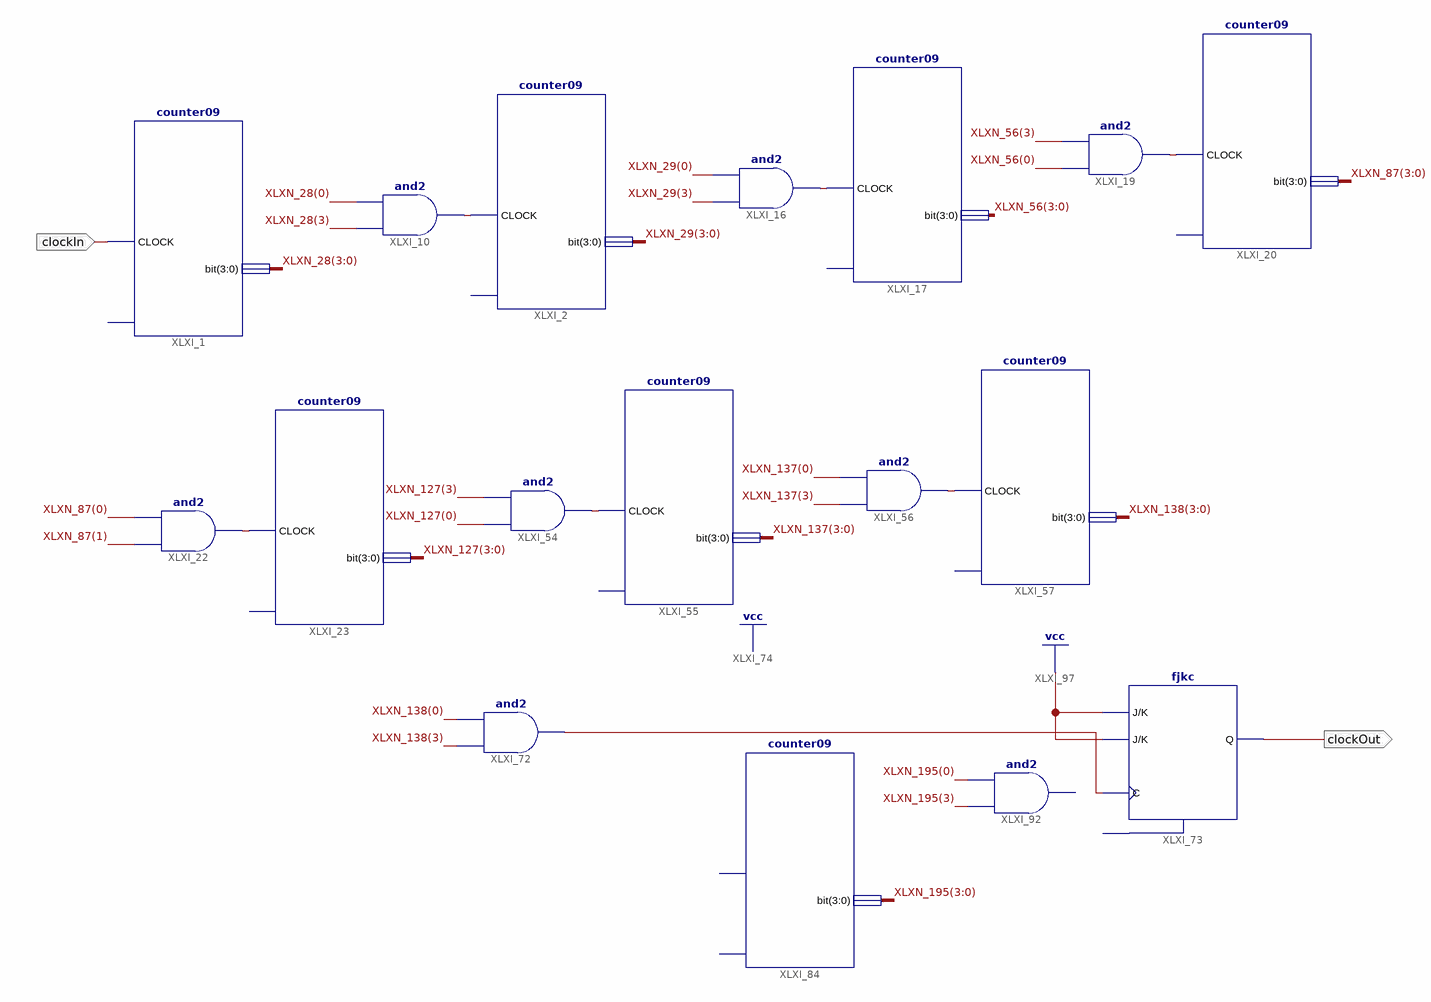
[diagram p0: schematic sheet 1]
// Xilinx ISE schematic to1Hz.sch (spartan6) as structural Verilog: 17 symbols, 2 ports
module to1Hz (
  input  clockIn,
  output clockOut
);

  wire XLXN_51, XLXN_55, XLXN_59, XLXN_63, XLXN_114, XLXN_117, XLXN_220;
  wire [3:0] XLXN_28, XLXN_29, XLXN_56, XLXN_87, XLXN_127, XLXN_137, XLXN_138, XLXN_195;

  counter09 XLXI_1 (.CLOCK(clockIn), .\bit (XLXN_28));  // open: clear
  counter09 XLXI_2 (.CLOCK(XLXN_51), .\bit (XLXN_29));  // open: clear
  and XLXI_10 (XLXN_51, XLXN_28[3], XLXN_28[0]);
  and XLXI_16 (XLXN_55, XLXN_29[3], XLXN_29[0]);
  counter09 XLXI_17 (.CLOCK(XLXN_55), .\bit (XLXN_56));  // open: clear
  and XLXI_19 (XLXN_59, XLXN_56[0], XLXN_56[3]);
  counter09 XLXI_20 (.CLOCK(XLXN_59), .\bit (XLXN_87));  // open: clear
  and XLXI_22 (XLXN_63, XLXN_87[1], XLXN_87[0]);
  counter09 XLXI_23 (.CLOCK(XLXN_63), .\bit (XLXN_127));  // open: clear
  and XLXI_54 (XLXN_114, XLXN_127[0], XLXN_127[3]);
  counter09 XLXI_55 (.CLOCK(XLXN_114), .\bit (XLXN_137));  // open: clear
  counter09 XLXI_57 (.CLOCK(XLXN_117), .\bit (XLXN_138));  // open: clear
  and XLXI_56 (XLXN_117, XLXN_137[3], XLXN_137[0]);
  counter09 XLXI_84 (.\bit (XLXN_195));  // open: CLOCK, clear
  fjkc XLXI_73 (.C(XLXN_220), .J(1'b1), .K(1'b1), .Q(clockOut));  // open: CLR
  // and2 XLXI_92 has open pins: I0=XLXN_195[3], I1=XLXN_195[0], O=open
  and XLXI_72 (XLXN_220, XLXN_138[3], XLXN_138[0]);
endmodule
